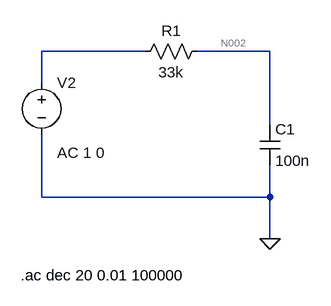
[diagram p0: schematic circuito_i_pratica_4.asc]
circuito_i_pratica_4.asc, the LTspice schematic file:
Version 4
SHEET 1 920 680
WIRE 240 32 80 32
WIRE 432 32 320 32
WIRE 80 80 80 32
WIRE 432 144 432 32
WIRE 80 256 80 160
WIRE 432 256 432 208
WIRE 432 256 80 256
WIRE 432 320 432 256
FLAG 432 320 0
SYMBOL res 336 16 R90
WINDOW 0 0 56 VBottom 2
WINDOW 3 32 56 VTop 2
SYMATTR InstName R1
SYMATTR Value 33k
SYMBOL voltage 80 64 R0
WINDOW 123 24 124 Left 2
WINDOW 39 0 0 Left 0
SYMATTR Value2 AC 1 0
SYMATTR InstName V2
SYMATTR Value ""
SYMBOL cap 416 144 R0
SYMATTR InstName C1
SYMATTR Value 100n
TEXT 48 376 Left 2 !.ac dec 20 0.01 100000

The netlist it stands for:
* circuito_i_pratica_4.asc
R1 N002 N001 33k
V2 N001 0 AC 1 0
C1 N002 0 100n
.ac dec 20 0.01 100000
.backanno
.end

* Results of the author's LTspice run, read from the files saved beside the schematic
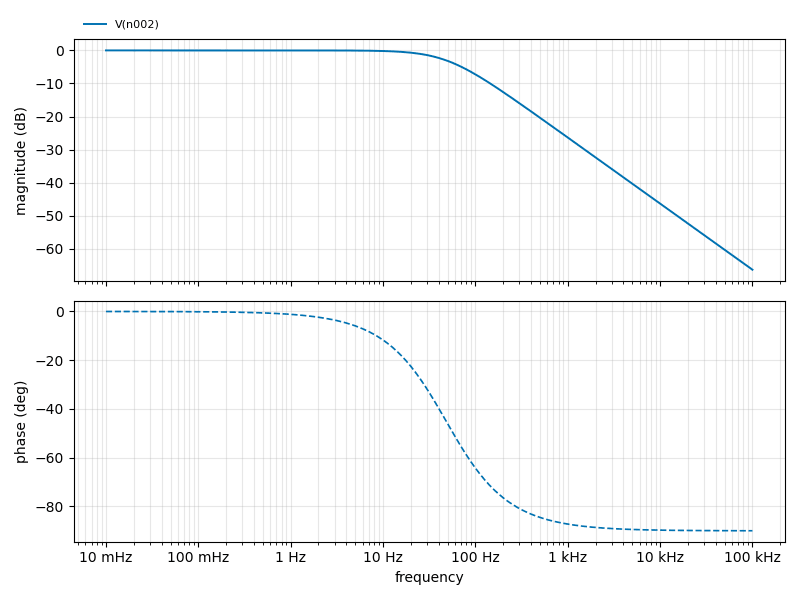
[diagram p1: AC Analysis of circuito_i_pratica_4.asc, plotted from the saved traces]
* AC Analysis, 1 run:
*   V(n002): -0.00 dB at 10 mHz, -66.33 dB at 100 kHz, peak -0.00 dB at 10 mHz, 3 dB below the peak at 48.16 Hz